# EasyEDA Pro project ProProject_ad9959控制板_2024-07-03.epro

# Schematic Schematic1
Create Date: 2024-06-16; Page Name: P1; Project Name: ad9959控制板; Schematic Name: Schematic1; Update Date: 2024-06-17; Company: 嘉立创EDA; Page Size: A4; Version: V1.0
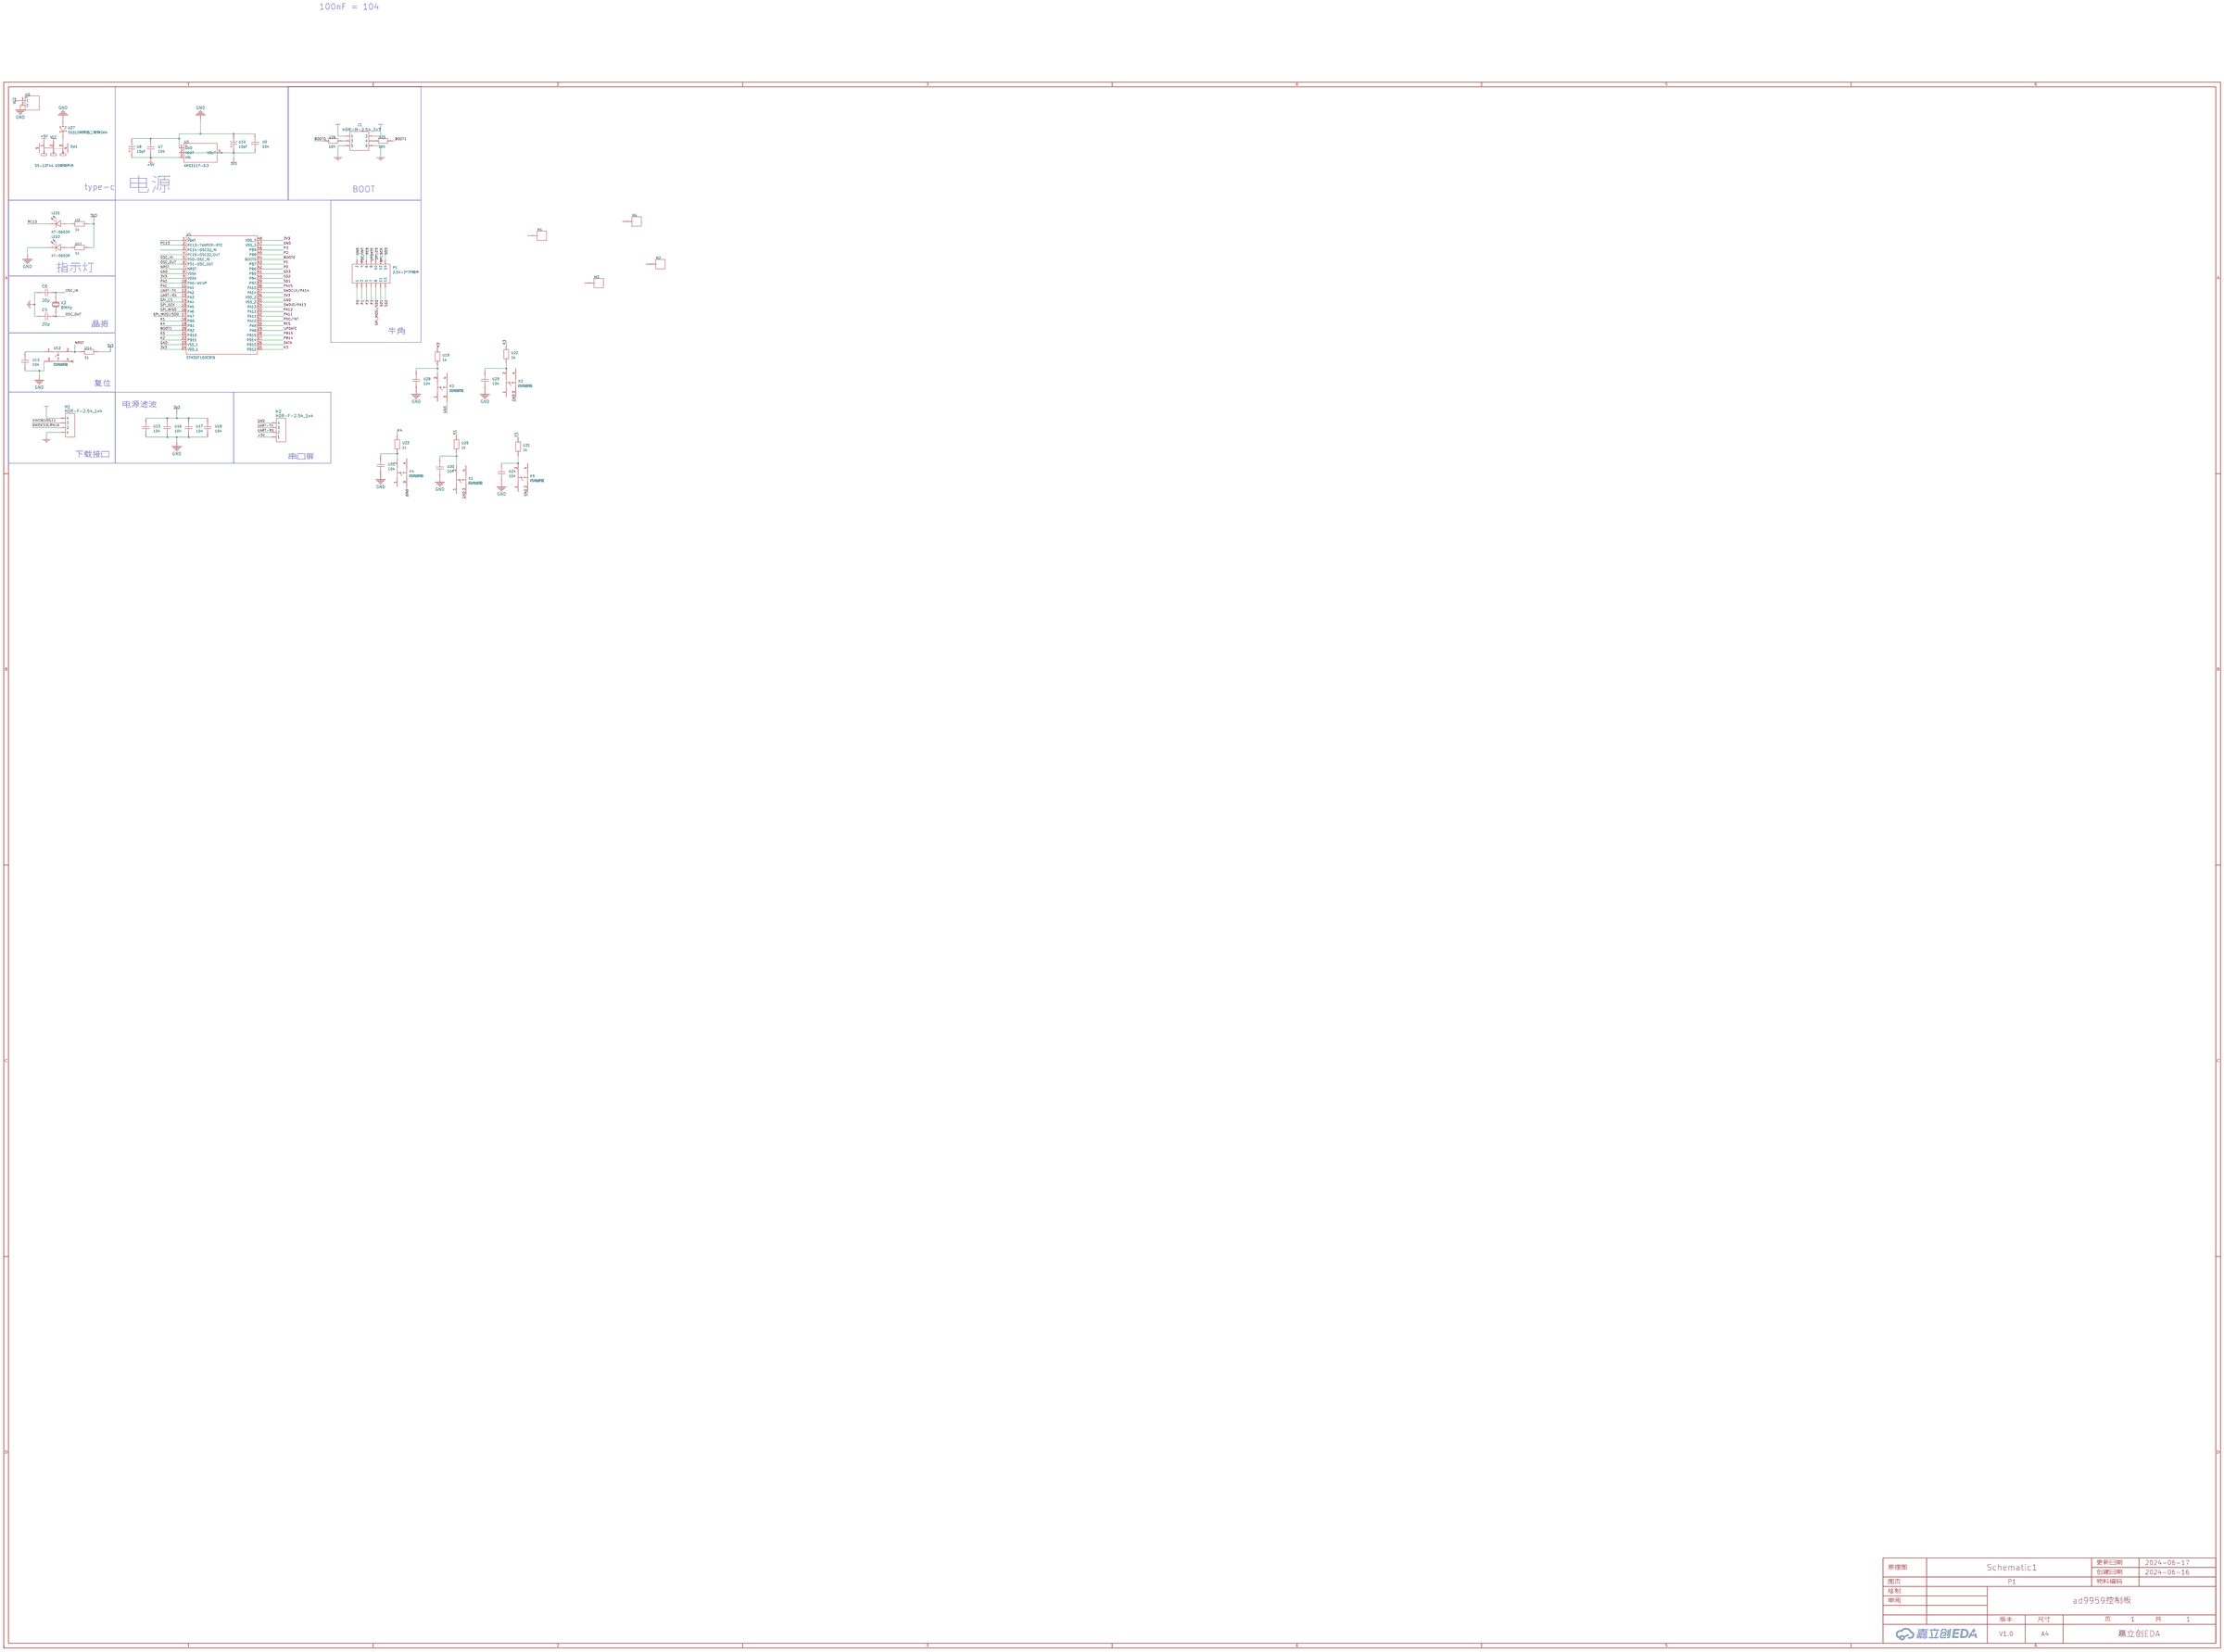
[diagram p0: schematic sheet]

## Parts
C5  20p  [R0603]
C6  20p  [R0603]
H1  HDR-F-2.54_1x4  [conn-th_4p-p2.50-xh2.54-4p]
H2  HDR-F-2.54_1x4  [conn-th_4p-p2.50-xh2.54-4p]
H3  -  [HDR-TH_2P-P2.54-V-M-1]
J1  HDR-M-2.54_2x3  [HDR-M-2.54_2X3]
K1  四角按键  [SW-SMD_4P-L6.0-W6.0-P4.50-LS9.2]
K2  四角按键  [SW-SMD_4P-L6.0-W6.0-P4.50-LS9.2]
K3  四角按键  [SW-SMD_4P-L6.0-W6.0-P4.50-LS9.2]
K4  四角按键  [SW-SMD_4P-L6.0-W6.0-P4.50-LS9.2]
K5  四角按键  [SW-SMD_4P-L6.0-W6.0-P4.50-LS9.2]
LED1  KT-0603R  [LED0603-RD]
LED2  KT-0603R  [LED0603-RD]
M1  -  [M3定位孔]
M2  -  [M3定位孔]
M3  -  [M3定位孔]
M4  -  [M3定位孔]
P1  2.54-2*7P简牛  [IDC-TH_14P-P2.54-V-R2-C7-S2.54]
SW1  SS-12F44 G5拨动开关  [SW-TH_SS-12F44-G5]
U1  STM32F103C8T6  [LQFP-48_L7.0-W7.0-P0.50-LS9.0-BL]
U3  1k  [R0603]
U5  AMS1117-3.3  [SOT-223-3_L6.5-W3.4-P2.30-LS7.0-BR]
U7  104  [C0603]
U8  10pF  [CAP-SMD_L3.6-W1.8-FD]
U9  104  [C0603]
U10  10pF  [CAP-SMD_L3.6-W1.8-FD]
U11  1k  [R0603]
U12  四角按键  [SW-SMD_4P-L6.0-W6.0-P4.50-LS9.2]
U13  104  [C0603]
U14  1k  [R0603]
U15  104  [C0603]
U16  104  [C0603]
U17  104  [C0603]
U18  104  [C0603]
U19  1k  [R0603]
U20  1k  [R0603]
U21  1k  [R0603]
U22  1k  [R0603]
U23  1k  [R0603]
U24  104  [C0603]
U25  10K  [R0603]
U26  10K  [R0603]
U27  SS310肖特基二极管SMA  [SMA_L4.3-W2.6-LS5.1-R-RD]
U28  104  [C0603]
U29  104  [C0603]
U30  104  [C0603]
U31  104  [C0603]
X2  8MHz  [HC-49US_L11.5-W4.5-P4.88]

## Library data of the parts
C5 C6 = 20p
H1 H2 = HDR-F-2.54_1x4: Supplier Part: C225501; Supplier: LCSC
H3 = HDR-M_2.54_1x2P: Supplier Part: C124375; Supplier Footprint: 插件; JLCPCB Part Class: 扩展库
J1 = HDR-M-2.54_2x3: Supplier Part: C65114; Supplier: LCSC
K1-K5 U12 = 四角按键: Supplier Part: C9900012348; Supplier Footprint: SW-PB; JLCPCB Part Class: 扩展库; Supplier: LCSC
LED1 LED2 = KT-0603R: 发光颜色:红色;功率:-;正向电流:-;主波长:-;二极管配置:-;透镜颜色:-;色温:-;发光角度:-;载带方式:-;工作温度:-40℃~+85℃;; LCSC Part Name: 0603 红灯 高亮; Supplier Part: C2286; Manufacturer: KENTO; Supplier Footprint: 0603; JLCPCB Part Class: 基础库; Datasheet: https://atta.szlcsc.com/upload/public/pdf/source/20160616/1466072038404.pdf; Supplier: LCSC; Emitted Color: 红色; Operating Temperature: -40℃~+85℃
M1-M4 = 定位孔
P1 = 2.54-2*7P简牛: 连接器类型:简牛座;间距:2.54mm;结构:2x7P;封装形式:直插;行距:2.54mm;排数:2;每排PIN数:7;触头材质:黄铜;触头镀层:金;; LCSC Part Name: 2.54mm 2x7P 排数:2 每排P数:7; Supplier Part: C11215; Manufacturer: BOOMELE(博穆精密); Supplier Footprint: 插件,P=2.54mm; JLCPCB Part Class: 扩展库; Datasheet: https://atta.szlcsc.com/upload/public/pdf/source/20131122/1457706661483.pdf; Supplier: LCSC; Connector Type: 简牛座; Pitch: 2.54mm; Structure: 2x7P; Holder Type: 直插; Row Spacing: 2.54mm; Number of Rows: 2; Pin Number in each Row: 7; Contact Material: 黄铜; Contact Plating: 金
SW1 = SS-12F44 G5拨动开关: 拨动开关，柄高5mm; Supplier Part: C22465; Supplier Footprint: 插件; JLCPCB Part Class: 扩展库; Supplier: LCSC
U1 = STM32F103C8T6: CPU内核:ARM-M3;程序存储容量:64KB;RAM总容量:20KB;GPIO端口数量:37;工作电压范围:2V~3.6V;CPU最大主频:72MHz;程序存储器类型:FLASH;; Supplier Part: C8734; Manufacturer: ST(意法半导体); Supplier Footprint: LQFP-48(7x7); JLCPCB Part Class: 扩展库; Datasheet: https://atta.szlcsc.com/upload/public/pdf/source/20220812/8363ACEC51AD55ECEB84799464F7CB85.pdf; Supplier: LCSC; CPU Core: ARM-M3; Program Storage Size: 64KB; RAM Size: 20KB; GPIO Ports Number: 37; Operating Voltage Range: 2V~3.6V; CPU Maximum Speed: 72MHz; Program Memory Type: FLASH; Operating Temperature Range: -40℃~+85℃; ADC (Bit): 12bit; Universal Serial Bus: 有; Peripheral/Function: 看门狗；DMA；看门狗；温度传感器; Watchdog: 有; Infrared Data Association: 有; Low-Voltage Detect: 有; Direct Memory Access: 有; Internal Oscillator: 有
U3 U11 U14 U19-U23 U25 U26 = RT0603DRE077K41L: 电阻类型:薄膜电阻;阻值:7.41kΩ;精度:±0.5%;功率:100mW;温度系数:±50ppm/℃;; LCSC Part Name: 薄膜电阻 7.41kΩ ±0.5% 100mW; Supplier Part: C863240; Manufacturer: YAGEO(国巨); Supplier Footprint: 0603; JLCPCB Part Class: 扩展库; Datasheet: https://atta.szlcsc.com/upload/public/pdf/source/20231208/4FA72C41188346433D85D99700271040.pdf; Supplier: LCSC; Type: 薄膜电阻; Tolerance: ±0.5%; Power(Watts): 100mW; Temperature Coefficient: ±50ppm/℃; Operating Temperature Range: -55℃~+155℃
U5 = AMS1117-3.3_C6186: 输出类型:固定;最大输入电压:-;输出电压:3.3V;最大输出电流:1A;电源纹波抑制比(PSRR):72dB@(120Hz);输出极性:正极;; LCSC Part Name: 输出3.3V 1A; Supplier Part: C6186; Manufacturer: AMS; Supplier Footprint: SOT-223; JLCPCB Part Class: 基础库; Datasheet: https://atta.szlcsc.com/upload/public/pdf/source/20180727/C6186_7A095716F0823C02F1997A905E26C086.pdf; Supplier: LCSC; Output Type: 固定; Output Voltage: 3.3V; MAX Output Current: 1A; Power Supply Rejection Ratio (PSRR): 72dB@(120Hz); Dropout Voltage: 1.3V@(800mA); Output Polarity: 正极; Number of Outputs: 1
U7 U9 U13 U15-U18 U24 U28-U31 = 0603YC104JAT4A: 容值:100nF;精度:±5%;额定电压:16V;材质(温度系数):X7R;; LCSC Part Name: 100nF ±5% 16V; Supplier Part: C2169226; Manufacturer: Kyocera AVX; Supplier Footprint: 0603; JLCPCB Part Class: 扩展库; Datasheet: https://atta.szlcsc.com/upload/public/pdf/source/20211125/9559F68C371FC513E807C3C71A51015C.pdf; Supplier: LCSC; Tolerance: ±5%; Voltage Rated: 16V; Temperature Coefficient: X7R
U8 U10 = 195D225X9020S2T: 容值:2.2uF;精度:±10%;额定电压:20V;等效串联电阻:-;; LCSC Part Name: 2.2uF ±10% 20V; Supplier Part: C1956237; Manufacturer: VISHAY(威世); Supplier Footprint: 1507; JLCPCB Part Class: 扩展库; Datasheet: https://atta.szlcsc.com/upload/public/pdf/source/20210426/88F2513BEF8B2267FEA4E813FE6B635F.pdf; Supplier: LCSC; Tolerance: ±10%; Rated Voltage: 20V; Operating Temperature: -55℃~+125℃
U27 = SS310肖特基二极管SMA: Supplier Part: C9900014981; Supplier Footprint: SS310SMA110V; JLCPCB Part Class: 扩展库; Supplier: LCSC
X2 = 8MHz: Supplier: LCSC; Supplier Part: C280058; Manufacturer: ZheJiang East Crystal Elec; Manufacturer Part: B08000J067

## Nets
3V3: H1.1(4) J1.1 J1.2 U1.9(VDDA) U1.24(VDD_1) U1.36(VDD_2) U1.48(VDD_3) U3.2 U5.2(VOUT) U5.4(VOUT) U9.1 U10.1 U11.2 U14.2 U15.1 U16.1 U17.1 U18.1
+5V: H2.4(1) SW1.1 U5.3(VIN) U7.1 U8.1
GND: C5.1 C6.1 H1.4(1) H2.1(4) H3.2 J1.5 J1.6 K1.3 K2.3 K3.3 K4.3 K5.3 LED2.1(K) P1.2 U1.8(VSSA) U1.23(VSS_1) U1.35(VSS_2) U1.47(VSS_3) U5.1(GND) U7.2 U8.2 U9.2 U10.2 U12.3 U13.2 U15.2 U16.2 U17.2 U18.2 U24.2 U27.1(A) U28.2 U29.2 U30.2 U31.2
VCC: H3.1 SW1.2
BOOT0: U1.44(BOOT0) U26.1
BOOT1: U1.20(PB2) U25.2
DATA: U1.26(PB13)
K1: U1.18(PB0) U20.2
K2: U1.22(PB11) U19.1
K3: U1.25(PB12) U22.2
K4: U1.19(PB1) U23.2
K5: U1.21(PB10) U21.2
NRST: U1.7(NRST) U12.2 U14.1
OSC_IN: C6.2 U1.5(PD0-OSC_IN) X2.1(OSC1)
OSC_OUT: C5.2 U1.6(PD1-OSC_OUT) X2.2(OSC2)
P0: P1.1 U1.42(PB6)
P1: P1.3 U1.43(PB7)
P2: P1.5 U1.45(PB8)
P3: P1.7 U1.46(PB9)
PA0: U1.10(PA0-WKUP)
PA1: U1.11(PA1)
PA11: U1.32(PA11)
PA12: U1.33(PA12)
PA15: U1.38(PA15)
PB14: U1.27(PB14)
PB15: U1.28(PB15)
PC13: LED1.1(K) U1.2(PC13-TAMPER-RTC)
PDC/INT: P1.4 U1.31(PA10)
RES: P1.6 U1.30(PA9)
SD1: P1.11 U1.39(PB3)
SD2: P1.13 U1.40(PB4)
SD3: P1.14 U1.41(PB5)
SPI_CS: P1.10 U1.14(PA4)
SPI_MISO: U1.16(PA6)
SPI_MOSI/SD0: P1.9 U1.17(PA7)
SPI_SCK: P1.12 U1.15(PA5)
SWDCLK/PA14: H1.3(2) U1.37(PA14)
SWDIO/PA13: H1.2(3) U1.34(PA13)
UART-RX: H2.3(2) U1.13(PA3)
UART-TX: H2.2(3) U1.12(PA2)
UPDATE: P1.8 U1.29(PA8)
$1N1836: LED1.2(A) U3.1
$1N1883: LED2.2(A) U11.1
$1N2205: U12.1 U13.1
$1N2429: J1.3 U26.2
$1N4530: K5.2 U21.1 U24.1
$1N4735: J1.4 U25.1
$1N6738: SW1.3 U27.2(K)
$1N6987: K2.2 U19.2 U28.1
$1N7156: K3.2 U22.1 U29.1
$1N7161: K4.2 U23.1 U31.1
$1N7166: K1.2 U20.1 U30.1

Not connected (* = marked no-connect by the designer): K1 1 4; K2 1 4; K3 1 4; K4 1 4; K5 1 4; M1 1; M2 1; M3 1; M4 1; SW1 4 5; U1 1(VBAT) 3(PC14-OSC32_IN) 4(PC15-OSC32_OUT); U12 4*

## Notes on the sheet
- 100nF = 104
- type-c
- 电源
- BOOT
- 指示灯
- 晶振
- 牛角
- 复位
- 电源滤波
- 下载接口
- 串口屏

# Board PCB1
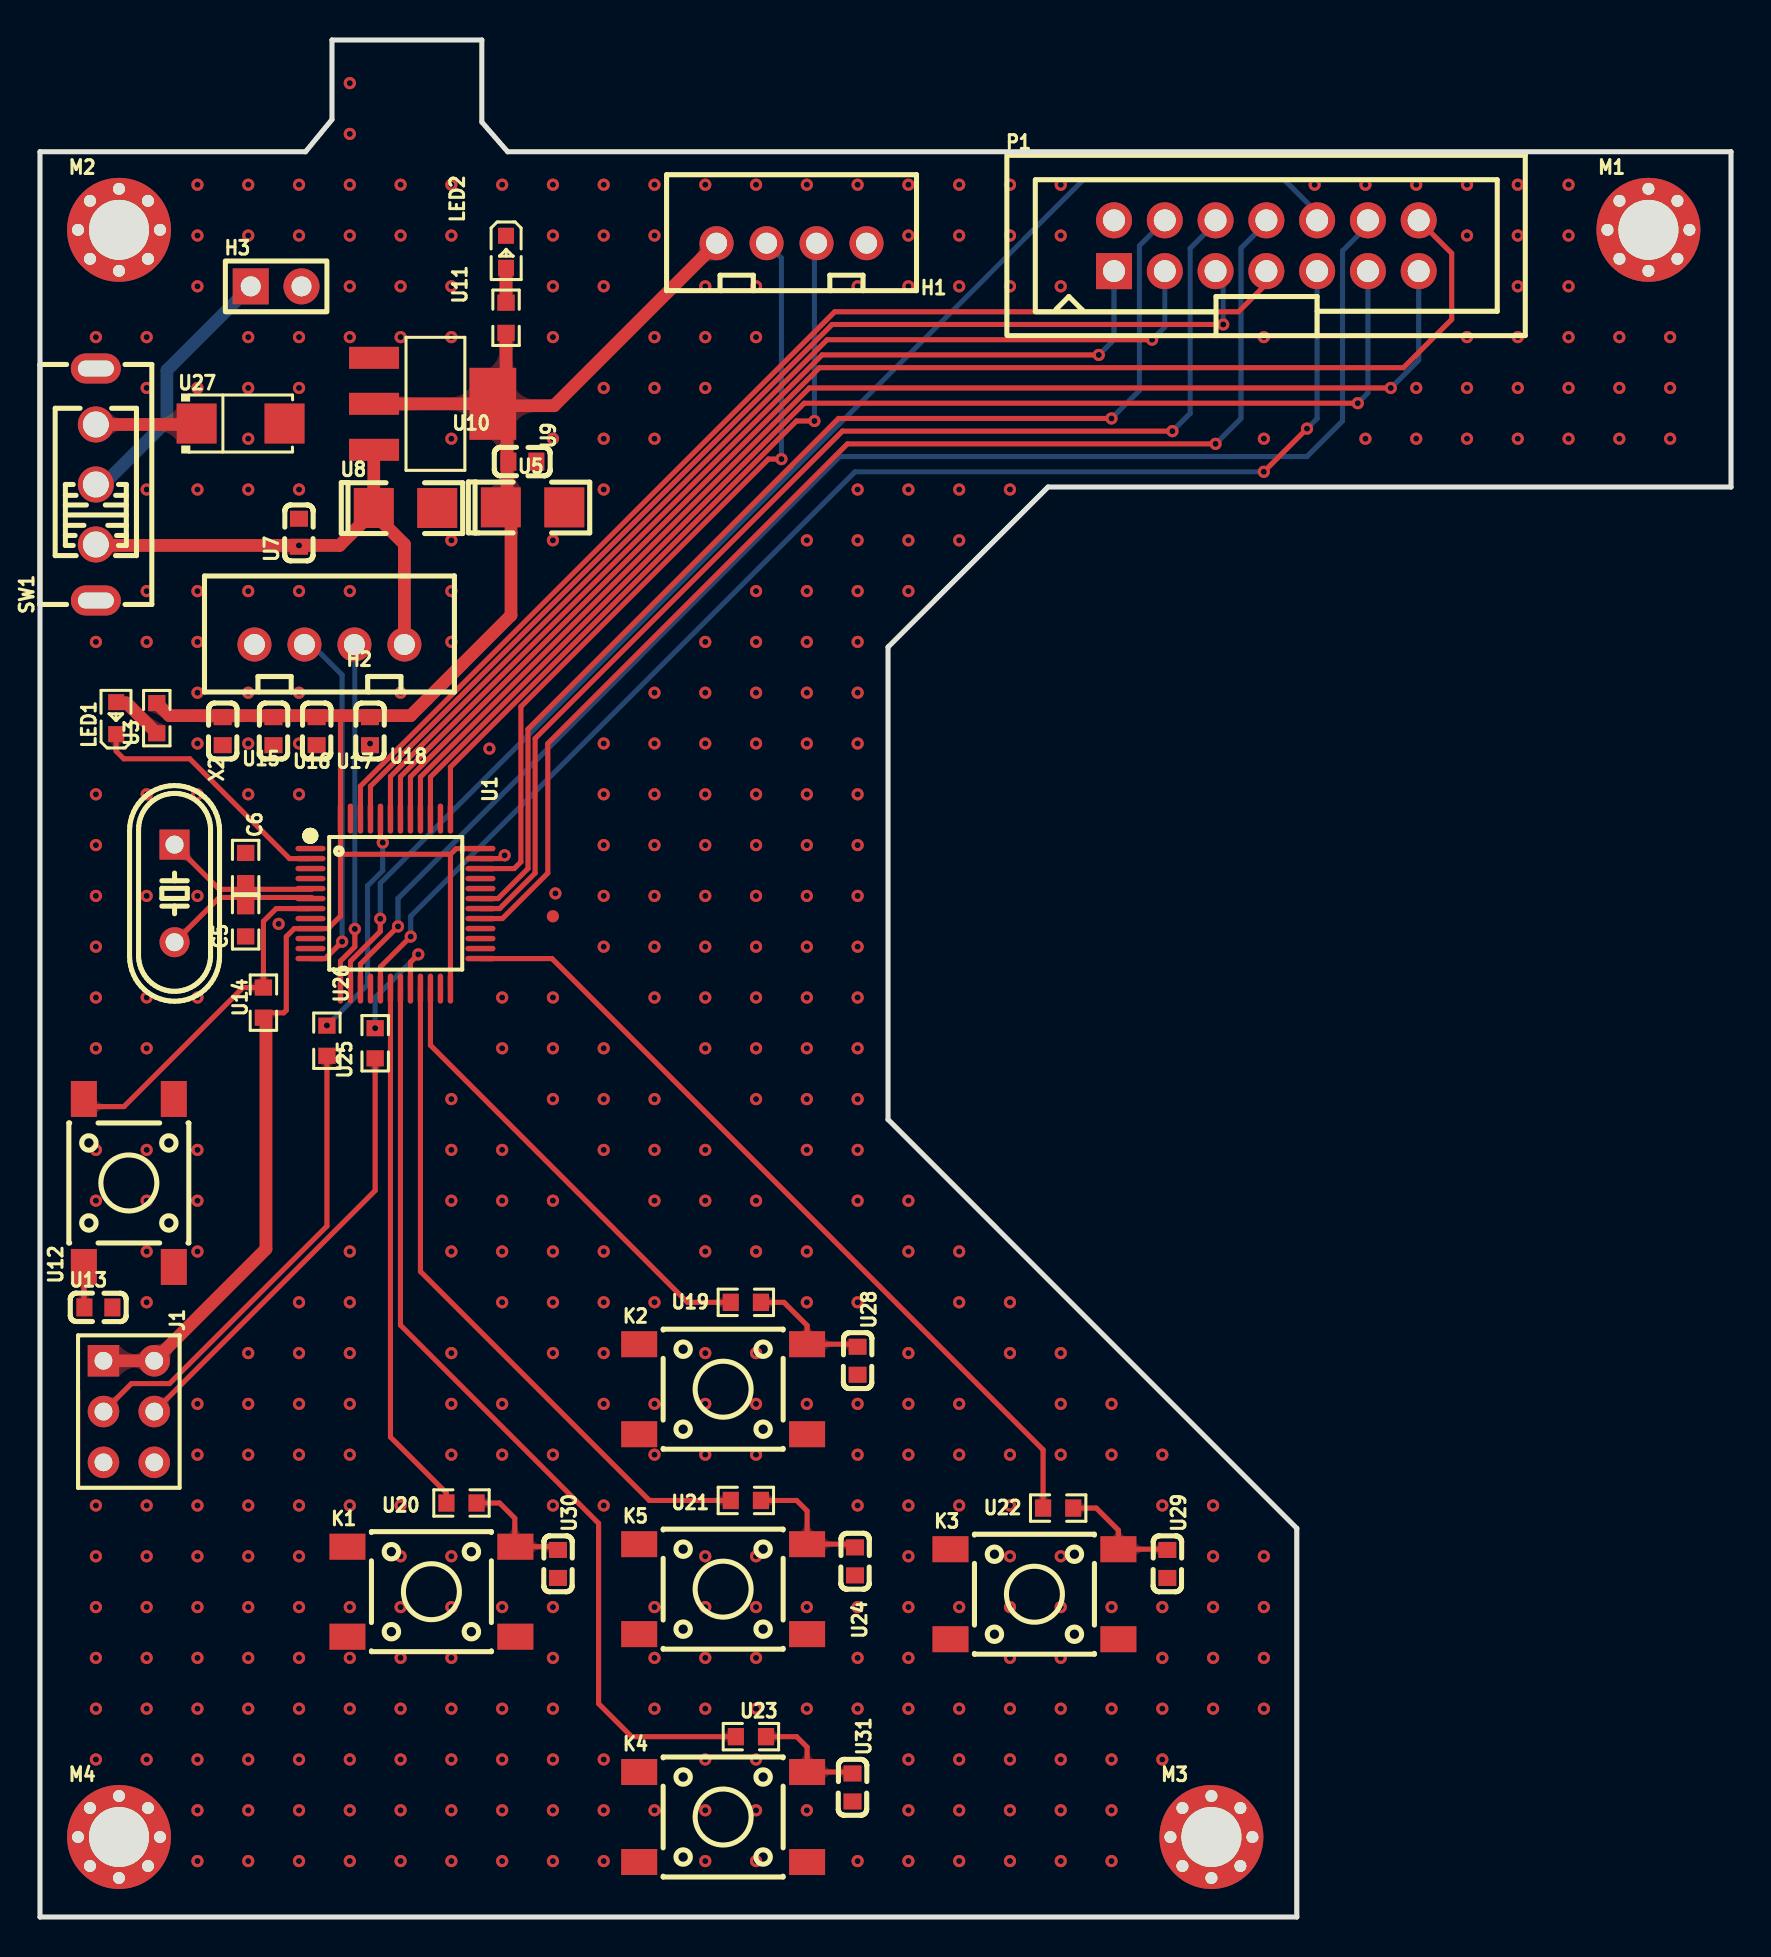
[diagram p1: board, top side]
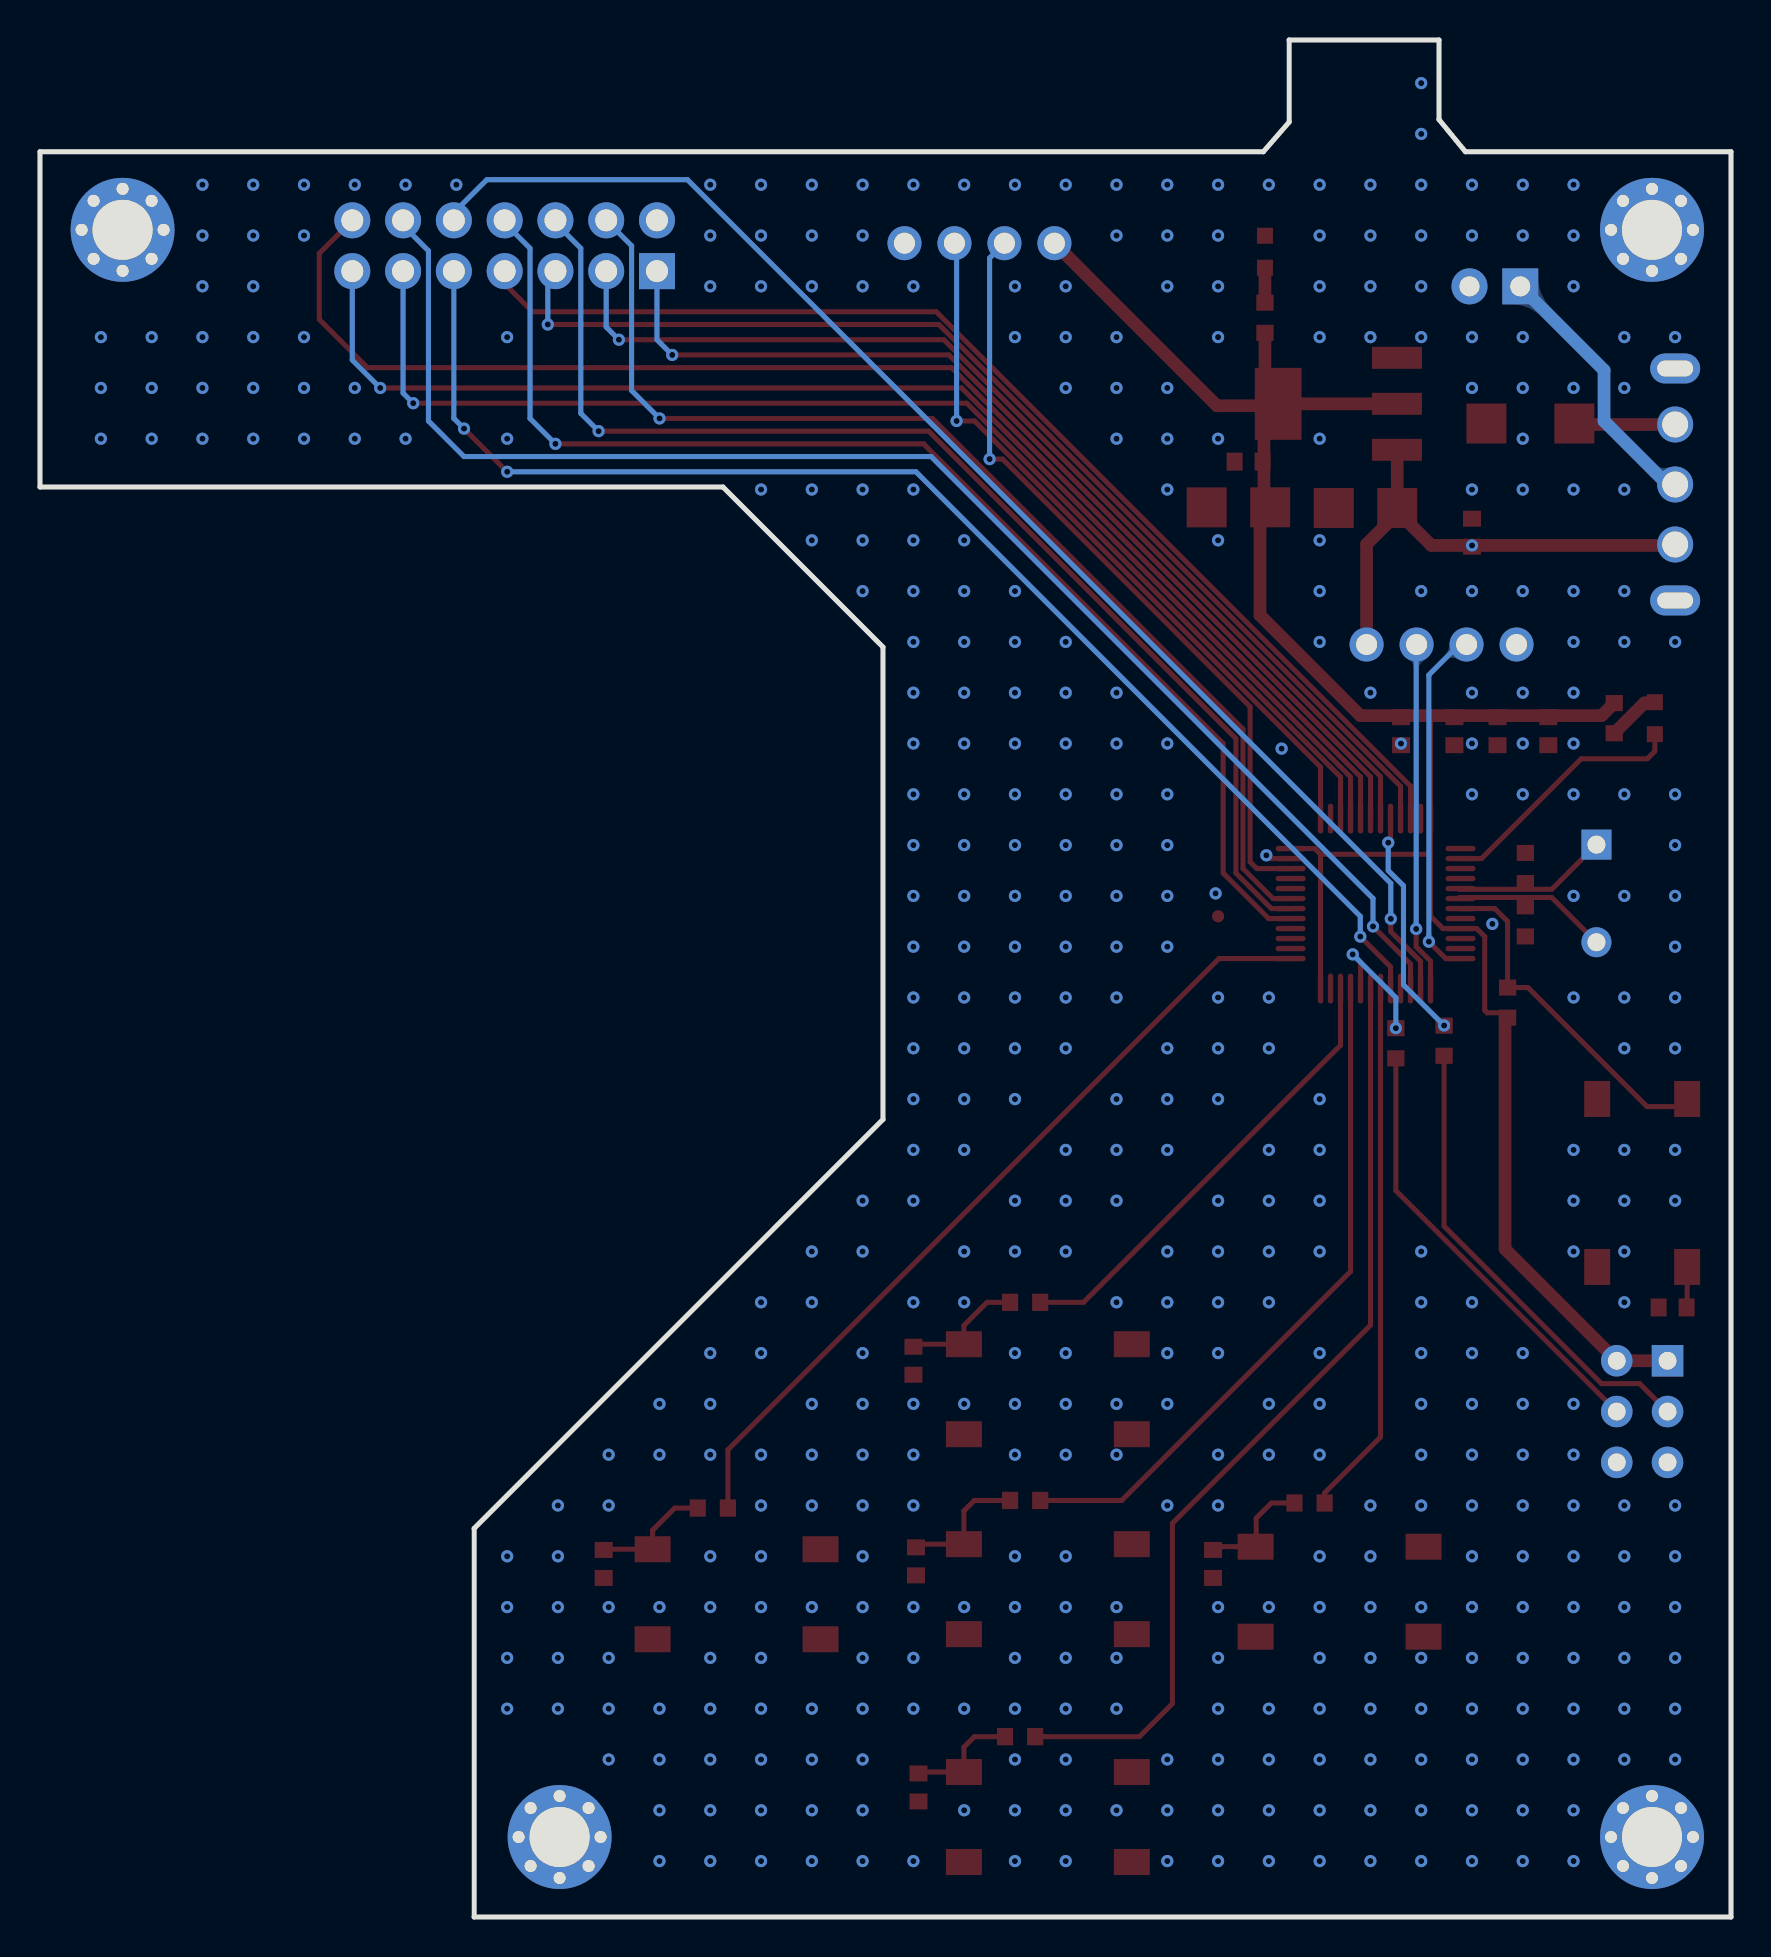
[diagram p2: board, bottom side, seen from below]

Outline 84.58 x 93.85 mm; copper layers: Top Layer, Bottom Layer. Coordinates in mm from the lower left corner of the outline.
Outline path: 0,88.27 13.28,88.27 14.61,89.88 14.61,93.85 22.1,93.85 22.1,89.75 23.39,88.27 84.58,88.27 84.58,71.5 50.42,71.5 42.42,63.5 42.42,39.88 62.87,19.43 62.87,0 0,0 0,88.27
Stack: Top Layer 0.035mm / Dielectric1 1.51mm FR4 er 4.5 / Bottom Layer 0.035mm

## Design rules (mm)
net OSC_IN: DP1
net OSC_OUT: DP1
template: 自定义配置
spacing copperThickness1oz (default): track to track 0.102, other pairs 0.152 to 0.3
spacing copperThickness2oz: track to track 0.203, other pairs 0.152 to 0.3
track width copperThickness1oz (default): min 0.127, default 0.254, max 2.54
track width copperThickness2oz: min 0.203, default 0.254, max 2.54
differential pair differentialPair (default): width min 0.127, default 0.254, max 2.54; gap min 0.152, default 0.152
via viaSize (default): diameter min 0.5, default 0.61, max 10; hole min 0.3, default 0.305, max 6.3

## Placement (name value [footprint] x y rotation side)
C5  20p  [R0603]  10.29 49.78 90 top
C6  20p  [R0603]  10.29 52.45 270 top
H1  HDR-F-2.54_1x4  [conn-th_4p-p2.50-xh2.54-4p]  37.59 83.69 180 top
H2  HDR-F-2.54_1x4  [conn-th_4p-p2.50-xh2.54-4p]  14.48 63.63 180 top
H3  -  [HDR-TH_2P-P2.54-V-M-1]  11.81 81.53 0 top
J1  HDR-M-2.54_2x3  [HDR-M-2.54_2X3]  3.17 27.81 270 top
K1  四角按键  [SW-SMD_4P-L6.0-W6.0-P4.50-LS9.2]  19.58 16.27 0 top
K2  四角按键  [SW-SMD_4P-L6.0-W6.0-P4.50-LS9.2]  34.17 26.39 0 top
K3  四角按键  [SW-SMD_4P-L6.0-W6.0-P4.50-LS9.2]  49.74 16.14 0 top
K4  四角按键  [SW-SMD_4P-L6.0-W6.0-P4.50-LS9.2]  34.17 5 0 top
K5  四角按键  [SW-SMD_4P-L6.0-W6.0-P4.50-LS9.2]  34.17 16.39 0 top
LED1  KT-0603R  [LED0603-RD]  3.81 59.94 90 top
LED2  KT-0603R  [LED0603-RD]  23.31 83.27 270 top
M1  -  [M3定位孔]  80.45 84.36 0 top
M2  -  [M3定位孔]  3.95 84.36 0 top
M3  -  [M3定位孔]  58.59 4 0 top
M4  -  [M3定位孔]  3.95 4 0 top
NOREF  -  [Pad_e319]  25.65 50.04 0 top
P1  2.54-2*7P简牛  [IDC-TH_14P-P2.54-V-R2-C7-S2.54]  61.34 83.57 0 top
SW1  SS-12F44 G5拨动开关  [SW-TH_SS-12F44-G5]  2.79 71.63 90 top
U1  STM32F103C8T6  [LQFP-48_L7.0-W7.0-P0.50-LS9.0-BL]  17.78 50.67 270 top
U3  1k  [R0603]  5.84 59.94 90 top
U5  AMS1117-3.3  [SOT-223-3_L6.5-W3.4-P2.30-LS7.0-BR]  19.68 75.66 180 top
U7  104  [C0603]  12.95 69.21 90 top
U8  10pF  [CAP-SMD_L3.6-W1.8-FD]  18.28 70.45 0 top
U9  104  [C0603]  24.13 72.77 0 top
U10  10pF  [CAP-SMD_L3.6-W1.8-FD]  24.64 70.48 0 top
U11  1k  [R0603]  23.31 79.96 270 top
U12  四角按键  [SW-SMD_4P-L6.0-W6.0-P4.50-LS9.2]  4.44 36.7 90 top
U13  104  [C0603]  2.92 30.48 0 top
U14  1k  [R0603]  11.18 45.72 270 top
U15  104  [C0603]  9.14 59.29 270 top
U16  104  [C0603]  11.68 59.29 270 top
U17  104  [C0603]  13.84 59.29 270 top
U18  104  [C0603]  16.5 59.29 270 top
U19  1k  [R0603]  35.31 30.73 0 top
U20  1k  [R0603]  21.08 20.7 180 top
U21  1k  [R0603]  35.31 20.83 180 top
U22  1k  [R0603]  50.93 20.45 180 top
U23  1k  [R0603]  35.56 9.02 180 top
U24  104  [C0603]  40.77 17.78 270 top
U25  10K  [R0603]  16.76 43.69 90 top
U26  10K  [R0603]  14.35 43.81 270 top
U27  SS310肖特基二极管SMA  [SMA_L4.3-W2.6-LS5.1-R-RD]  10.03 74.68 0 top
U28  104  [C0603]  40.89 27.81 270 top
U29  104  [C0603]  56.39 17.65 270 top
U30  104  [C0603]  25.91 17.65 270 top
U31  104  [C0603]  40.64 6.48 270 top
X2  8MHz  [HC-49US_L11.5-W4.5-P4.88]  6.73 51.18 270 top

## Footprints (pads in the part's own frame, mm; a bottom-side part is the same pattern mirrored in y, then rotated)
C0603
  rect 0.8x0.9 smd: 1(-0.7,0) 2(0.7,0)
CAP-SMD_L3.6-W1.8-FD
  rect 2x2 smd: 1(-1.587,0.001) 2(1.587,-0.001)
conn-th_4p-p2.50-xh2.54-4p
  round 1.7 hole 1.05: 1(3.75,0) 2(1.25,0) 3(-1.25,0) 4(-3.75,0)
HC-49US_L11.5-W4.5-P4.88
  rect 1.5x1.5 hole 0.9: 1(-2.44,0)
  round 1.5 hole 0.9: 2(2.44,0)
HDR-M-2.54_2X3
  rect 1.575x1.575 hole 0.889: 1(0,0)
  round 1.575 hole 0.889: 2(0,2.54) 3(2.54,0) 4(2.54,2.54) 5(5.08,0) 6(5.08,2.54)
HDR-TH_2P-P2.54-V-M-1
  rect 1.8x1.8 hole 1: 1(-1.27,0)
  round 1.8 hole 1: 2(1.27,0)
IDC-TH_14P-P2.54-V-R2-C7-S2.54
  rect 1.8x1.8 hole 1.1: 1(-7.62,-1.27)
  round 1.8 hole 1.1: 2(-7.62,1.27) 3(-5.08,-1.27) 4(-5.08,1.27) 5(-2.54,-1.27) 6(-2.54,1.27) 7(0,-1.27) 8(0,1.27) 9(2.54,-1.27) 10(2.54,1.27) 11(5.08,-1.27) 12(5.08,1.27) 13(7.62,-1.27) 14(7.62,1.27)
LED0603-RD
  rect 0.8x0.8 smd: 1(-0.799,0) 2(0.799,0)
LQFP-48_L7.0-W7.0-P0.50-LS9.0-BL
  oval 0.27x1.5 smd: 1(-2.75,-4.25) 2(-2.25,-4.25) 3(-1.75,-4.25) 4(-1.25,-4.25) 5(-0.75,-4.25) 6(-0.25,-4.25) 7(0.25,-4.25) 8(0.75,-4.25) 9(1.25,-4.25) 10(1.75,-4.25) 11(2.25,-4.25) 12(2.75,-4.25) 25(2.75,4.25) 26(2.25,4.25) 27(1.75,4.25) 28(1.25,4.25) 29(0.75,4.25) 30(0.25,4.25) 31(-0.25,4.25) 32(-0.75,4.25) 33(-1.25,4.25) 34(-1.75,4.25) 35(-2.25,4.25) 36(-2.75,4.25)
  oval 1.5x0.27 smd: 13(4.25,-2.75) 14(4.25,-2.25) 15(4.25,-1.75) 16(4.25,-1.25) 17(4.25,-0.75) 18(4.25,-0.25) 19(4.25,0.25) 20(4.25,0.75) 21(4.25,1.25) 22(4.25,1.75) 23(4.25,2.25) 24(4.25,2.75) 37(-4.25,2.75) 38(-4.25,2.25) 39(-4.25,1.75) 40(-4.25,1.25) 41(-4.25,0.75) 42(-4.25,0.25) 43(-4.25,-0.25) 44(-4.25,-0.75) 45(-4.25,-1.25) 46(-4.25,-1.75) 47(-4.25,-2.25) 48(-4.25,-2.75)
M3定位孔
  round 0.6 hole 0.605x0.6: 1(-2.05,0) 1(-1.45,-1.45) 1(0,2.05) 1(0,-2.05) 1(1.45,1.45) 1(2.05,0)
  round 0.6 hole 0.6x0.605: 1(-1.45,1.45) 1(1.45,-1.45)
  round 5.2 hole 3.005x3: 1(0,0)
Pad_e319
  round 0.61 smd: TP3(0,0)
R0603
  rect 0.806x0.864 smd: 1(-0.753,0) 2(0.753,0)
SMA_L4.3-W2.6-LS5.1-R-RD
  rect 2x2 smd: 1(2.2,0) 2(-2.2,0)
SOT-223-3_L6.5-W3.4-P2.30-LS7.0-BR
  rect 2.5x1.1 smd: 1(2.97,-2.3) 2(2.97,0) 3(2.97,2.3)
  rect 2.34x3.6 smd: 4(-2.97,0)
SW-SMD_4P-L6.0-W6.0-P4.50-LS9.2
  rect 1.8x1.3 smd: 1(-4.2,2.25) 2(4.2,2.25) 3(-4.2,-2.25) 4(4.2,-2.25)
SW-TH_SS-12F44-G5
  round 1.8 hole 1.3: 1(-3,0) 2(0,0) 3(3,0)
  oval 1.5x2.5 hole 0.8x1.8: 4(5.8,0) 5(-5.8,0)

## Nets
As in the schematic.

Pads without a net: K1 1 4; K2 1 4; K3 1 4; K4 1 4; K5 1 4; M1 1; M2 1; M3 1; M4 1; NOREF TP3; SW1 4 5; U12 4

## Via types
v1: diameter 0.61, hole 0.305, Top Layer to Bottom Layer, 474 vias

## Routing (per net, layer and track width the routed paths; a pad name or vN(x,y) marks a point on that pad's centre or on a via; arc(x,y) is an arc through that point)
3V3: length 109
  Top Layer w0.254: 15.03,53.14 20.53,53.14 ; 15.03,53.14 U1.48 15.03,60.03 15.07,60.07 ; 15.03,53.14 15.03,50.05 14.41,49.42 U1.9 12.72,49.42 12.32,49.02 12.32,45.34 12.19,45.21 11.42,45.21 U14.2 ; 20.53,53.14 20.82,53.42 U1.36 ; 20.53,53.14 U1.24
  Top Layer w0.635: J1.1 J1.2 11.3,33.4 11.3,44.97 ; H1.1 25.71,75.56 22.99,75.56 ; 22.65,75.66 23.36,74.95 23.36,71.15 23.56,70.96 23.56,65.09 18.54,60.07 6.47,60.07 U3.2 ; 22.65,75.66 U5.2 ; 22.65,75.66 23.31,76.32 U11.2
+5V: length 24.7
  Top Layer w0.635: U8.1 16.69,73.35 U5.3 ; H2.4 18.23,68.64 16.64,70.23 14.99,68.58 v1(12.95,68.58) 2.84,68.58 SW1.1
GND: length 1.3
  Top Layer w0.254: U1.35 23.08,52.92 v1(23.24,53.09)
  vias: v1(2.8,79) v1(2.8,63.76) v1(2.8,56.14) v1(2.8,53.6) v1(2.8,51.06) v1(2.8,48.52) v1(2.8,45.98) v1(2.8,43.44) v1(2.8,38.36) v1(2.8,35.82) v1(2.8,20.58) v1(2.8,18.04) v1(2.8,15.5) v1(2.8,12.96) v1(2.8,10.42) v1(2.8,7.88) v1(5.34,79) v1(5.34,76.46) v1(5.34,71.38) v1(5.34,66.3) v1(5.34,63.76) v1(5.34,56.14) v1(5.34,51.06) v1(5.34,45.98) v1(5.34,43.44) v1(5.34,38.36) v1(5.34,35.82) v1(5.34,33.28) v1(5.34,30.74) v1(5.34,20.58) v1(5.34,18.04) v1(5.34,15.5) v1(5.34,12.96) v1(5.34,10.42) v1(5.34,7.88) v1(7.88,86.62) v1(7.88,84.08) v1(7.88,81.54) v1(7.88,76.46) v1(7.88,71.38) v1(7.88,66.3) v1(7.88,63.76) v1(7.88,61.22) v1(7.88,58.68) v1(7.88,56.14) v1(7.88,51.06) v1(7.88,45.98) v1(7.88,38.36) v1(7.88,35.82) v1(7.88,33.28) v1(7.88,25.66) v1(7.88,23.12) v1(7.88,20.58) v1(7.88,18.04) v1(7.88,15.5) v1(7.88,12.96) v1(7.88,10.42) v1(7.88,7.88) v1(7.88,5.34) v1(7.88,2.8) v1(10.42,86.62) v1(10.42,84.08) v1(10.42,79) v1(10.42,76.46) v1(10.42,73.92) v1(10.42,71.38) v1(10.42,66.3) v1(10.42,61.22) v1(10.42,58.68) v1(10.42,56.14) v1(10.42,28.2) v1(10.42,25.66) v1(10.42,23.12) v1(10.42,20.58) v1(10.42,18.04) v1(10.42,15.5) v1(10.42,12.96) v1(10.42,10.42) v1(10.42,7.88) v1(10.42,5.34) v1(10.42,2.8) v1(11.94,49.66) v1(12.96,86.62) v1(12.96,84.08) v1(12.96,79) v1(12.96,76.46) v1(12.96,71.38) v1(12.96,66.3) v1(12.96,61.22) v1(12.96,58.68) v1(12.96,56.14) v1(12.96,30.74) v1(12.96,28.2) v1(12.96,25.66) v1(12.96,23.12) v1(12.96,20.58) v1(12.96,18.04) v1(12.96,15.5) v1(12.96,12.96) v1(12.96,10.42) v1(12.96,7.88) v1(12.96,5.34) v1(12.96,2.8) v1(15.5,91.7) v1(15.5,89.16) v1(15.5,86.62) v1(15.5,84.08) v1(15.5,81.54) v1(15.5,79) v1(15.5,66.3) v1(15.5,33.28) v1(15.5,30.74) v1(15.5,28.2) v1(15.5,25.66) v1(15.5,23.12) v1(15.5,20.58) v1(15.5,15.5) v1(15.5,12.96) v1(15.5,10.42) v1(15.5,7.88) v1(15.5,5.34) v1(15.5,2.8) v1(16.51,58.67) v1(18.04,86.62) v1(18.04,84.08) v1(18.04,81.54) v1(18.04,79) v1(18.04,61.22) v1(18.04,20.58) v1(18.04,18.04) v1(18.04,15.5) v1(18.04,12.96) v1(18.04,10.42) v1(18.04,7.88) v1(18.04,5.34) v1(18.04,2.8) v1(20.58,86.62) v1(20.58,84.08) v1(20.58,81.54) v1(20.58,79) v1(20.58,73.92) v1(20.58,68.84) v1(20.58,66.3) v1(20.58,63.76) v1(20.58,40.9) v1(20.58,38.36) v1(20.58,35.82) v1(20.58,33.28) v1(20.58,28.2) v1(20.58,25.66) v1(20.58,23.12) v1(20.58,18.04) v1(20.58,15.5) v1(20.58,12.96) v1(20.58,10.42) v1(20.58,7.88) v1(20.58,5.34) v1(20.58,2.8) v1(22.48,58.42) v1(23.12,86.62) v1(23.12,45.98) v1(23.12,43.44) v1(23.12,38.36) v1(23.12,35.82) v1(23.12,33.28) v1(23.12,30.74) v1(23.12,25.66) v1(23.12,23.12) v1(23.12,15.5) v1(23.12,10.42) v1(23.12,7.88) v1(23.12,5.34) v1(23.12,2.8) v1(25.66,86.62) v1(25.66,84.08) v1(25.66,81.54) v1(25.66,79) v1(25.66,73.92) v1(25.66,68.84) v1(25.66,45.98) v1(25.66,43.44) v1(25.66,40.9) v1(25.66,35.82) v1(25.66,33.28) v1(25.66,30.74) v1(25.66,28.2) v1(25.66,23.12) v1(25.66,20.58) v1(25.66,15.5) v1(25.66,12.96) v1(25.66,10.42) v1(25.66,7.88) v1(25.66,5.34) v1(25.66,2.8) v1(25.78,51.18) v1(28.2,86.62) v1(28.2,84.08) v1(28.2,81.54) v1(28.2,76.46) v1(28.2,73.92) v1(28.2,71.38) v1(28.2,58.68) v1(28.2,56.14) v1(28.2,53.6) v1(28.2,51.06) v1(28.2,48.52) v1(28.2,43.44) v1(28.2,40.9) v1(28.2,38.36) v1(28.2,33.28) v1(28.2,30.74) v1(28.2,28.2) v1(28.2,25.66) v1(28.2,20.58) v1(28.2,7.88) v1(28.2,5.34) v1(28.2,2.8) v1(30.74,86.62) v1(30.74,84.08) v1(30.74,79) v1(30.74,76.46) v1(30.74,73.92) v1(30.74,61.22) v1(30.74,58.68) v1(30.74,56.14) v1(30.74,53.6) v1(30.74,51.06) v1(30.74,48.52) v1(30.74,45.98) v1(30.74,40.9) v1(30.74,38.36) v1(30.74,35.82) v1(30.74,30.74) v1(30.74,25.66) v1(30.74,23.12) v1(30.74,15.5) v1(30.74,12.96) v1(30.74,10.42) v1(30.74,5.34) v1(33.28,86.62) v1(33.28,81.54) v1(33.28,79) v1(33.28,76.46) v1(33.28,63.76) v1(33.28,61.22) v1(33.28,58.68) v1(33.28,56.14) v1(33.28,53.6) v1(33.28,51.06) v1(33.28,48.52) v1(33.28,45.98) v1(33.28,43.44) v1(33.28,38.36) v1(33.28,35.82) v1(33.28,33.28) v1(33.28,28.2) v1(33.28,25.66) v1(33.28,23.12) v1(33.28,18.04) v1(33.28,15.5) v1(33.28,12.96) v1(33.28,10.42) v1(33.28,7.88) v1(33.28,5.34) v1(33.28,2.8) v1(35.82,86.62) v1(35.82,81.54) v1(35.82,79) v1(35.82,66.3) v1(35.82,63.76) v1(35.82,61.22) v1(35.82,58.68) v1(35.82,56.14) v1(35.82,53.6) v1(35.82,51.06) v1(35.82,48.52) v1(35.82,45.98) v1(35.82,43.44) v1(35.82,40.9) v1(35.82,35.82) v1(35.82,33.28) v1(35.82,28.2) v1(35.82,25.66) v1(35.82,23.12) v1(35.82,18.04) v1(35.82,15.5) v1(35.82,12.96) v1(35.82,10.42) v1(35.82,7.88) v1(35.82,5.34) v1(35.82,2.8) v1(38.36,86.62) v1(38.36,68.84) v1(38.36,66.3) v1(38.36,63.76) v1(38.36,61.22) v1(38.36,58.68) v1(38.36,56.14) v1(38.36,53.6) v1(38.36,51.06) v1(38.36,48.52) v1(38.36,45.98) v1(38.36,43.44) v1(38.36,40.9) v1(38.36,38.36) v1(38.36,33.28) v1(38.36,30.74) v1(38.36,25.66) v1(38.36,15.5) v1(38.36,10.42) v1(38.36,5.34) v1(40.9,86.62) v1(40.9,81.54) v1(40.9,71.38) v1(40.9,68.84) v1(40.9,66.3) v1(40.9,63.76) v1(40.9,61.22) v1(40.9,58.68) v1(40.9,56.14) v1(40.9,53.6) v1(40.9,51.06) v1(40.9,48.52) v1(40.9,45.98) v1(40.9,43.44) v1(40.9,40.9) v1(40.9,38.36) v1(40.9,35.82) v1(40.9,30.74) v1(40.9,25.66) v1(40.9,23.12) v1(40.9,20.58) v1(40.9,15.5) v1(40.9,12.96) v1(40.9,10.42) v1(40.9,2.8) v1(43.44,86.62) v1(43.44,84.08) v1(43.44,81.54) v1(43.44,71.38) v1(43.44,68.84) v1(43.44,66.3) v1(43.44,35.82) v1(43.44,33.28) v1(43.44,28.2) v1(43.44,25.66) v1(43.44,23.12) v1(43.44,20.58) v1(43.44,18.04) v1(43.44,15.5) v1(43.44,12.96) v1(43.44,10.42) v1(43.44,7.88) v1(43.44,5.34) v1(43.44,2.8) v1(45.98,86.62) v1(45.98,84.08) v1(45.98,81.54) v1(45.98,71.38) v1(45.98,68.84) v1(45.98,33.28) v1(45.98,30.74) v1(45.98,25.66) v1(45.98,23.12) v1(45.98,20.58) v1(45.98,15.5) v1(45.98,10.42) v1(45.98,7.88) v1(45.98,5.34) v1(45.98,2.8) v1(48.52,86.62) v1(48.52,84.08) v1(48.52,81.54) v1(48.52,71.38) v1(48.52,30.74) v1(48.52,28.2) v1(48.52,23.12) v1(48.52,20.58) v1(48.52,18.04) v1(48.52,15.5) v1(48.52,12.96) v1(48.52,10.42) v1(48.52,7.88) v1(48.52,5.34) v1(48.52,2.8) v1(51.06,86.62) v1(51.06,84.08) v1(51.06,81.54) v1(51.06,28.2) v1(51.06,25.66) v1(51.06,23.12) v1(51.06,18.04) v1(51.06,15.5) v1(51.06,12.96) v1(51.06,10.42) v1(51.06,7.88) v1(51.06,5.34) v1(51.06,2.8) v1(53.6,25.66) v1(53.6,23.12) v1(53.6,15.5) v1(53.6,10.42) v1(53.6,7.88) v1(53.6,5.34) v1(53.6,2.8) v1(56.14,23.12) v1(56.14,20.58) v1(56.14,15.5) v1(56.14,12.96) v1(56.14,10.42) v1(56.14,7.88) v1(58.68,20.58) v1(58.68,18.04) v1(58.68,15.5) v1(58.68,12.96) v1(58.68,10.42) v1(61.22,79) v1(61.22,73.92) v1(61.22,18.04) v1(61.22,15.5) v1(61.22,12.96) v1(61.22,10.42) v1(63.76,86.62) v1(66.3,86.62) v1(66.3,73.92) v1(68.84,86.62) v1(68.84,76.46) v1(68.84,73.92) v1(71.38,86.62) v1(71.38,84.08) v1(71.38,79) v1(71.38,76.46) v1(71.38,73.92) v1(73.92,86.62) v1(73.92,84.08) v1(73.92,81.54) v1(73.92,79) v1(73.92,76.46) v1(73.92,73.92) v1(76.46,86.62) v1(76.46,84.08) v1(76.46,81.54) v1(76.46,79) v1(76.46,76.46) v1(76.46,73.92) v1(79,79) v1(79,76.46) v1(79,73.92) v1(81.54,79) v1(81.54,76.46) v1(81.54,73.92)
VCC: length 13.3
  Bottom Layer w0.635: 10.54,81.53 6.35,77.34 6.35,74.8 3.17,71.63 SW1.2
BOOT0: length 11.6
  Top Layer w0.254: v1(17.14,53.72) 17.03,53.84 U1.44
  Bottom Layer w0.254: v1(14.35,44.58) 16.38,46.61 16.38,51.56 17.14,52.32 v1(17.14,53.72)
BOOT1: length 6.5
  Top Layer w0.254: U1.20 18.53,47.74 v1(18.92,48.13)
  Bottom Layer w0.254: 16.76,44.45 16.76,45.97 v1(18.92,48.13)
  vias: v1(16.76,44.44)
K1: length 26.9
  Top Layer w0.254: U1.18 17.53,24 20.33,21.2 U20.2
K2: length 23.2
  Top Layer w0.254: U1.22 19.53,43.59 32.38,30.73 U19.1
K3: length 41.2
  Top Layer w0.254: U22.2 50.17,23.36 25.61,47.92 U1.25
K4: length 47.4
  Top Layer w0.254: U23.2 29.59,9.02 27.94,10.67 27.94,19.69 18.03,29.59 U1.19
K5: length 34.4
  Top Layer w0.254: U1.21 19.03,32.28 30.48,20.83 U21.2
NRST: length 17.4
  Top Layer w0.254: U1.7 11.81,50.42 11.18,49.78 U14.1 10.15,46.47 4.2,40.52 2.19,40.52
OSC_IN: length 7.8
  Top Layer w0.254: X2.1 8.97,51.38 13.59,51.38
OSC_OUT: length 7.8
  Top Layer w0.254: 13.59,50.98 8.97,50.98 X2.2
P0: length 50.3
  Top Layer w0.254: U1.42 18.03,57.02 39.12,78.1 v1(52.96,78.1)
  Bottom Layer w0.254: P1.1 53.72,78.87 v1(52.96,78.1)
P1: length 52.9
  Top Layer w0.254: U1.43 17.53,57.03 39.37,78.87 v1(55.63,78.87)
  Bottom Layer w0.254: P1.3 56.26,79.5 v1(55.63,78.87)
P2: length 56.7
  Top Layer w0.254: U1.45 16.53,56.54 39.62,79.63 v1(59.18,79.63)
  Bottom Layer w0.254: v1(59.18,79.63) 59.18,81.91 58.8,82.3
P3: length 58
  Top Layer w0.254: U1.46 16.03,56.54 39.75,80.26 59.94,80.26 61.34,81.66 P1.7
PC13: length 12.8
  Top Layer w0.254: LED1.1 3.81,58.29 4.19,57.91 7.49,57.91 12.48,52.92 U1.2
PDC/INT: length 56.6
  Top Layer w0.254: v1(53.59,74.93) 39.94,74.93 24.41,59.4 24.41,52.43 22.91,50.92 U1.31
  Bottom Layer w0.254: P1.4 54.99,83.57 54.99,76.33 v1(53.59,74.93)
RES: length 59.9
  Top Layer w0.254: v1(56.64,74.3) 40.13,74.3 24.76,58.93 24.76,52.2 22.99,50.42 U1.30
  Bottom Layer w0.254: 58.8,84.84 58.8,84.71 57.53,83.44 57.53,75.18 v1(56.64,74.3)
SD1: length 63
  Top Layer w0.254: v1(65.91,75.69) 38.22,75.69 19.53,57 U1.39
  Bottom Layer w0.254: v1(65.91,75.69) 66.42,76.2 66.42,82.3
SD2: length 65.1
  Top Layer w0.254: U1.40 19.03,57 38.48,76.45 v1(67.56,76.45)
  Bottom Layer w0.254: P1.13 68.96,77.85 v1(67.56,76.45)
SD3: length 69.3
  Top Layer w0.254: U1.41 18.53,57.01 38.99,77.47 68.2,77.47 70.61,79.88 70.61,83.18 P1.14
SPI_CS: length 68.4
  Top Layer w0.254: v1(17.02,49.91) 17.02,49.28 15.53,47.79 U1.14
  Bottom Layer w0.254: P1.10 63.88,85.22 62.23,86.87 52.2,86.87 17.02,51.69 v1(17.02,49.91)
SPI_MOSI/SD0: length 67.3
  Top Layer w0.254: v1(63.37,74.42) v1(61.21,72.26) ; U1.17 17.03,47.51 v1(18.54,49.02)
  Bottom Layer w0.254: P1.9 63.88,74.93 v1(63.37,74.42) ; v1(61.21,72.26) 40.77,72.26 18.54,50.04 v1(18.54,49.02)
SPI_SCK: length 73
  Top Layer w0.254: U1.15 16.03,47.65 v1(17.91,49.53)
  Bottom Layer w0.254: 66.42,84.84 66.42,84.58 65.15,83.31 65.15,74.8 63.37,73.02 40,73.02 17.91,50.93 v1(17.91,49.53)
SWDCLK/PA14: length 36.9
  Top Layer w0.254: U1.37 20.53,57.5 37.84,74.8 v1(38.74,74.8)
  Bottom Layer w0.254: v1(38.74,74.8) 38.74,83.59 H1.3
SWDIO/PA13: length 39.2
  Top Layer w0.254: U1.34 23.72,52.42 24.05,52.76 24.05,60.52 36.43,72.9 v1(37.08,72.9)
  Bottom Layer w0.254: H1.2 37.08,82.95 v1(37.08,72.9)
UART-RX: length 17.5
  Top Layer w0.254: U1.13 15.03,47.8 15.75,48.51 v1(15.75,49.4)
  Bottom Layer w0.254: v1(15.75,49.4) 15.75,63.61 H2.3
UART-TX: length 17.8
  Top Layer w0.254: v1(15.11,48.77) 14.27,47.92 U1.12
  Bottom Layer w0.254: H2.2 13.59,63.63 15.11,62.1 v1(15.11,48.77)
UPDATE: length 62.6
  Top Layer w0.254: U1.29 23.13,49.92 25.4,52.2 25.4,58.67 40.39,73.66 v1(58.8,73.66)
  Bottom Layer w0.254: v1(58.8,73.66) 60.07,74.93 60.07,83.44 61.34,84.71 P1.8
$1N1836: length 2.7
  Top Layer w0.635: LED1.2 3.81,60.71 4.33,60.71 U3.1
$1N1883: length 1.7
  Top Layer w0.635: U11.1 LED2.2
$1N2205: length 2
  Top Layer w0.254: U12.1 2.19,30.51 U13.1
$1N2429: length 23.5
  Top Layer w0.254: U26.2 14.35,34.54 6.48,26.67 4.57,26.67 J1.3
$1N4530: length 6.7
  Top Layer w0.254: U21.1 37.85,20.83 38.37,20.3 K5.2 40.6,18.64 U24.1
$1N4735: length 22.2
  Top Layer w0.254: U25.1 16.76,36.32 J1.4
$1N6738: length 5.1
  Top Layer w0.635: SW1.3 7.78,74.63 U27.2
$1N6987: length 6.3
  Top Layer w0.254: U19.2 37.21,30.73 38.37,29.57 K2.2 40.77,28.64 U28.1
$1N7156: length 6.1
  Top Layer w0.254: U29.1 56.35,18.39 K3.2 53.94,19.34 52.83,20.45 U22.1
$1N7161: length 5.8
  Top Layer w0.254: 40.64,7.25 K4.2 38.37,8.49 37.85,9.02 U23.1
$1N7166: length 5.9
  Top Layer w0.254: U30.1 25.75,18.52 23.78,18.52 23.75,18.54 23.75,19.94 22.99,20.7 U20.1

## Copper pours and planes (outline as drawn; the poured copper is in the pictures)
GND on Top Layer: -5.72,95.12 92.2,95.12 92.2,-7.75 -5.72,-7.75
GND on Bottom Layer: -3.17,94.49 96.39,94.49 96.39,-6.22 -3.17,-6.22

Small or netless copper shapes (teardrops, artwork), in the pictures only: 84 on Top Layer, 10 on Bottom Layer

## Text on the board
Top Layer: 74.42/44.02/9.43
